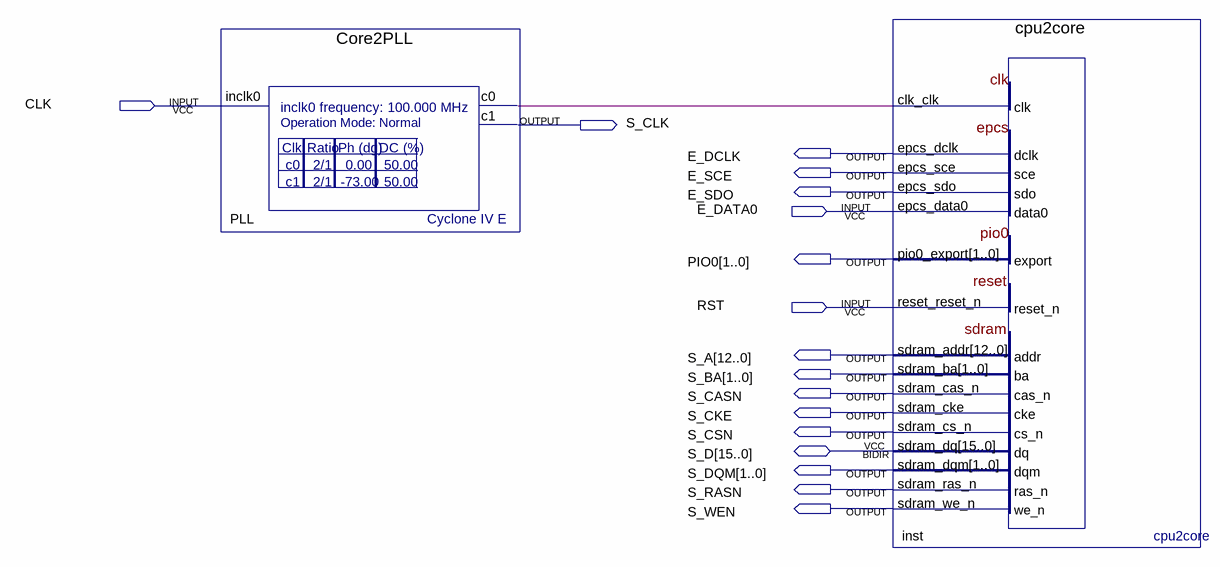
[diagram p0: schematic sheet]
// Quartus schematic Nios2Core2.bdf as structural Verilog: 2 symbols, 17 pins
module Nios2Core2 (
  input  CLK,
  input  E_DATA0,
  input  RST,
  inout  [15:0] S_D,
  output S_CLK,
  output E_DCLK,
  output E_SCE,
  output E_SDO,
  output [1:0] PIO0,
  output [12:0] S_A,
  output [1:0] S_BA,
  output S_CASN,
  output S_CKE,
  output S_CSN,
  output [1:0] S_DQM,
  output S_RASN,
  output S_WEN
);

  wire PLL_c0;

  Core2PLL PLL (.inclk0(CLK), .c0(PLL_c0), .c1(S_CLK));
  cpu2core inst (
    .clk_clk(PLL_c0), .epcs_data0(E_DATA0), .reset_reset_n(RST), .epcs_dclk(E_DCLK), .epcs_sce(E_SCE),
    .epcs_sdo(E_SDO), .pio0_export(PIO0), .sdram_addr(S_A), .sdram_ba(S_BA), .sdram_cas_n(S_CASN),
    .sdram_cke(S_CKE), .sdram_cs_n(S_CSN), .sdram_dqm(S_DQM), .sdram_ras_n(S_RASN), .sdram_we_n(S_WEN),
    .sdram_dq(S_D));
endmodule
